# EAGLE design BitrisATMEGA (EAGLE 9.5.0)
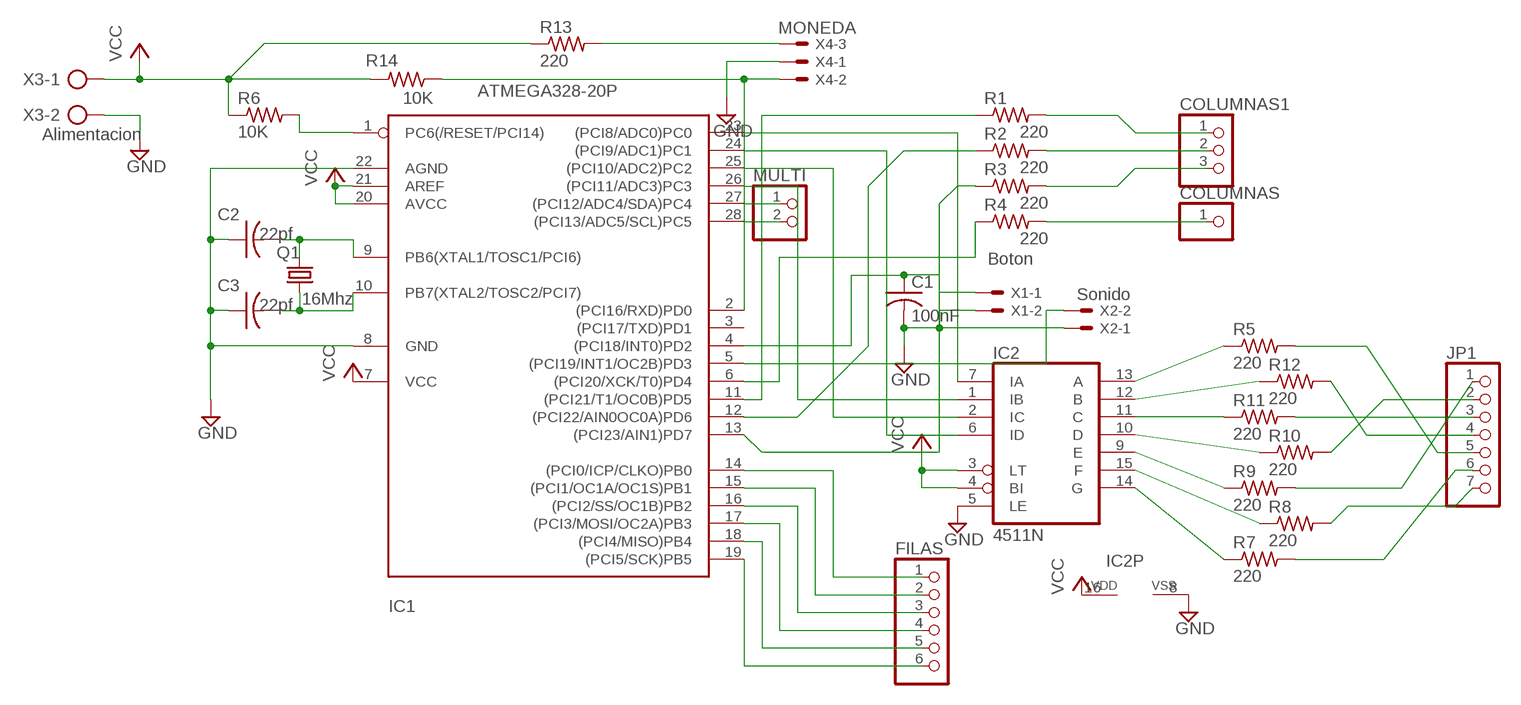
[diagram p0: schematic, sheet 1]

## Parts
C1  100nF  C-USC0805  [C0805]
C2  22pf  C-USC0805  [C0805]
C3  22pf  C-USC0805  [C0805]
COLUMNAS  PINHD-1X1  [1X01]
COLUMNAS1  PINHD-1X3  [1X03]
FILAS  PINHD-1X6  [1X06]
IC1  ATMEGA328-20P  [DIL28-3]
IC2  4511N  [DIL16]
JP1  PINHD-1X7  [1X07]
MULTI  PINHD-1X2  [1X02]
Q1  16Mhz  CRYSTALHC49S  [HC49/S]
R1  220  R-US_M0805  [M0805]
R2  220  R-US_M0805  [M0805]
R3  220  R-US_M0805  [M0805]
R4  220  R-US_0204/5  [0204/5]
R5  220  R-US_M0805  [M0805]
R6  10K  R-US_M0805  [M0805]
R7  220  R-US_M0805  [M0805]
R8  220  R-US_M0805  [M0805]
R9  220  R-US_M0805  [M0805]
R10  220  R-US_M0805  [M0805]
R11  220  R-US_M0805  [M0805]
R12  220  R-US_M0805  [M0805]
R13  220  R-US_M0805  [M0805]
R14  10K  R-US_M0805  [M0805]
X1  Boton  22-23-2021  [22-23-2021]
X2  Sonido  22-23-2021  [22-23-2021]
X3  Alimentacion  AK500/2  [AK500/2]
X4  MONEDA  22-23-2031  [22-23-2031]

## Nets
GND: C1.2 C2.1 C3.1 IC1.8(GND) IC1.22(AGND) IC2.5(LE) IC2.8(VSS) X1.2 X2.1 X3.2 X4.1
N$1: COLUMNAS1.1 R1.2
N$2: COLUMNAS1.2 R2.2
N$3: COLUMNAS1.3 R3.2
N$4: COLUMNAS.1 R4.2
N$5: IC1.23((PCI8/ADC0)PC0) IC2.7(IA)
N$6: IC1.24((PCI9/ADC1)PC1) IC2.6(ID)
N$7: IC1.25((PCI10/ADC2)PC2) IC2.2(IC)
N$8: IC1.26((PCI11/ADC3)PC3) IC2.1(IB)
N$9: FILAS.1 IC1.14((PCI0/ICP/CLKO)PB0)
N$10: FILAS.2 IC1.15((PCI1/OC1A/OC1S)PB1)
N$11: FILAS.3 IC1.16((PCI2/SS/OC1B)PB2)
N$12: FILAS.4 IC1.17((PCI3/MOSI/OC2A)PB3)
N$13: FILAS.5 IC1.18((PCI4/MISO)PB4)
N$14: FILAS.6 IC1.19((PCI5/SCK)PB5)
N$15: IC1.27((PCI12/ADC4/SDA)PC4) MULTI.1
N$16: IC1.28((PCI13/ADC5/SCL)PC5) MULTI.2
N$17: IC1.6((PCI20/XCK/T0)PD4) R4.1
N$18: IC1.11((PCI21/T1/OC0B)PD5) R1.1
N$19: C2.2 IC1.9(PB6(XTAL1/TOSC1/PCI6)) Q1.2
N$20: C3.2 IC1.10(PB7(XTAL2/TOSC2/PCI7)) Q1.1
N$21: IC1.13((PCI23/AIN1)PD7) R3.1
N$23: IC2.10(D) R10.1
N$24: IC2.11(C) R11.1
N$25: IC2.12(B) R12.1
N$26: IC2.13(A) R5.1
N$27: IC2.9(E) R9.1
N$28: IC2.15(F) R8.1
N$29: IC2.14(G) R7.1
N$30: IC1.2((PCI16/RXD)PD0) R14.1 X4.2
N$32: IC1.5((PCI19/INT1/OC2B)PD3) X2.2
N$33: C1.1 IC1.4((PCI18/INT0)PD2) X1.1
N$34: IC1.1(PC6(/RESET/PCI14)) R6.2
N$35: JP1.1 R9.2
N$36: JP1.2 R10.2
N$37: JP1.3 R11.2
N$38: JP1.4 R12.2
N$39: JP1.5 R5.2
N$40: JP1.6 R7.2
N$41: JP1.7 R8.2
N$44: R13.2 X4.3
N$45: IC1.12((PCI22/AIN0OC0A)PD6) R2.1
VCC: IC1.7(VCC) IC1.20(AVCC) IC1.21(AREF) IC2.3(LT) IC2.4(BI) IC2.16(VDD) R6.1 R13.1 R14.2 X3.1
Unconnected: IC1.3((PCI17/TXD)PD1)

## Library data of the parts
C1-C3 = rcl:C-US: CAPACITOR, American symbol
COLUMNAS = pinhead:PINHD-1X1: PIN HEADER
COLUMNAS1 = pinhead:PINHD-1X3: PIN HEADER
FILAS = pinhead:PINHD-1X6: PIN HEADER
IC1 = atmega328:ATMEGA328*P: MICROCONTROLLER 32 kBytes FLASH 2 kBytes SRAM 1 kBytes EEPROM USART 8-channel 10 bit ADC
IC2 = 45xx:4511: BCD to 7-segment LATCH/DECODER/DRIVER
JP1 = pinhead:PINHD-1X7: PIN HEADER
MULTI = pinhead:PINHD-1X2: PIN HEADER
Q1 = crystal:CRYSTAL: CRYSTAL; OC_FARNELL: 1667008; OC_NEWARK: unknown
R1-R14 = rcl:R-US_: RESISTOR, American symbol
X1 X2 = con-molex:22-23-2021: .100" (2.54mm) Center Header - 2 Pin; MF: MOLEX; MPN: 22-23-2021; OC_FARNELL: 1462926; OC_NEWARK: 25C3832
X3 = con-ptr500:AK500/2: CONNECTOR; OC_FARNELL: unknown; OC_NEWARK: unknown
X4 = con-molex:22-23-2031: .100" (2.54mm) Center Header - 3 Pin; MF: MOLEX; MPN: 22-23-2031; OC_FARNELL: 1462950; OC_NEWARK: 30C0862

## Board
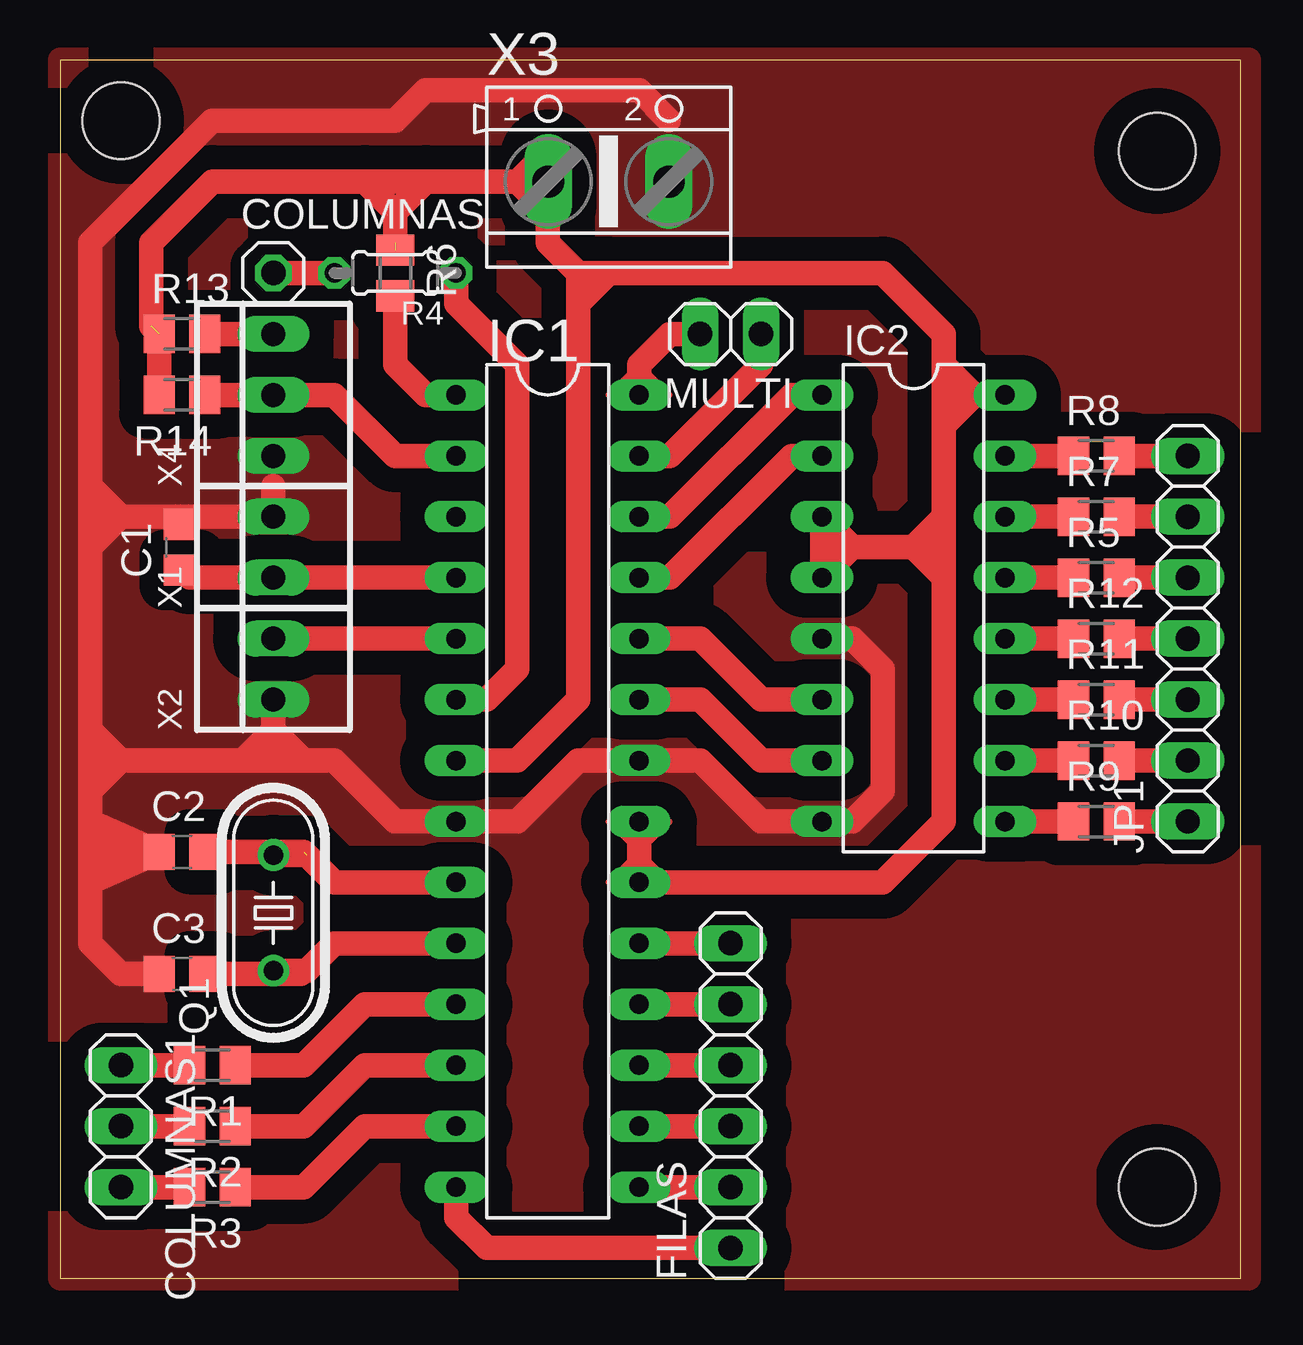
[diagram p1: board, top side]

Size 49.2 x 50.79 mm. Coordinates in mm from the lower left corner, seen from the top.
Outline: 0,0 49.2,0 49.2,50.79 0,50.79 0,0
Copper layers (1*16): Top 0.035mm / dielectric 1.5mm / Bottom 0.035mm
Design rules "default *": minimum track width 10mil, minimum drill 24mil, track to track 8mil, track to pad 8mil, pad to pad 8mil, via to via 8mil, smd to smd 8mil, copper to edge 0mil, drill to drill 8mil, minimum pad ring 10mil, minimum via ring 8mil, stop-mask expansion 4mil, vias tented up to drill 0mil, thermal gap 10mil
Holes 3.2 mm at 45.72,3.81 2.54,48.26 45.72,46.99

### Footprints (pad centres in the part's own frame; a part is rotated, then mirrored left to right if it is on the bottom)
C0805 = smd 1.3 x 1.5: 1 -0.95,0; 2 0.95,0
1X01 = drill 1.016 octagon: 1 0,0
1X03 = drill 1.016 long: 1 -2.54,0; 2 0,0; 3 2.54,0
1X06 = drill 1.016 long: 1 -6.35,0; 2 -3.81,0; 3 -1.27,0; 4 1.27,0; 5 3.81,0; 6 6.35,0
DIL28-3 = drill 0.813 long: 1 -16.51,-3.81; 2 -13.97,-3.81; 3 -11.43,-3.81; 4 -8.89,-3.81; 5 -6.35,-3.81; 6 -3.81,-3.81; 7 -1.27,-3.81; 8 1.27,-3.81; 9 3.81,-3.81; 10 6.35,-3.81; 11 8.89,-3.81; 12 11.43,-3.81; 13 13.97,-3.81; 14 16.51,-3.81; 15 16.51,3.81; 16 13.97,3.81; 17 11.43,3.81; 18 8.89,3.81; 19 6.35,3.81; 20 3.81,3.81; 21 1.27,3.81; 22 -1.27,3.81; 23 -3.81,3.81; 24 -6.35,3.81; 25 -8.89,3.81; 26 -11.43,3.81; 27 -13.97,3.81; 28 -16.51,3.81
DIL16 = drill 0.813 long: 1 -8.89,-3.81; 2 -6.35,-3.81; 3 -3.81,-3.81; 4 -1.27,-3.81; 5 1.27,-3.81; 6 3.81,-3.81; 7 6.35,-3.81; 8 8.89,-3.81; 9 8.89,3.81; 10 6.35,3.81; 11 3.81,3.81; 12 1.27,3.81; 13 -1.27,3.81; 14 -3.81,3.81; 15 -6.35,3.81; 16 -8.89,3.81
1X07 = drill 1.016 long: 1 -7.62,0; 2 -5.08,0; 3 -2.54,0; 4 0,0; 5 2.54,0; 6 5.08,0; 7 7.62,0
1X02 = drill 1.016 long: 1 -1.27,0; 2 1.27,0
HC49/S = drill 0.813: 1 -2.413,0; 2 2.413,0
M0805 = smd 1.3 x 1.6: 1 -0.95,0; 2 0.95,0
0204/5 = drill 0.813 octagon: 1 -2.54,0; 2 2.54,0
22-23-2021 = drill 1 long: 1 -1.27,0; 2 1.27,0
AK500/2 = drill 1.321 long: 1 -2.515,0; 2 2.515,0
22-23-2031 = drill 1 long: 1 -2.54,0; 2 0,0; 3 2.54,0

### Placement (x,y rotation side)
C1  5.08,30.48 90 top
C2  5.08,17.78 0 top
C3  5.08,12.7 0 top
COLUMNAS  8.89,41.91 0 top
COLUMNAS1  2.54,6.35 270 top
FILAS  27.94,7.62 90 top
IC1  20.32,20.32 270 top
IC2  35.56,27.94 270 top
JP1  46.99,26.67 90 top
MULTI  27.94,39.37 180 top
Q1  8.89,15.24 90 top
R1  6.35,8.89 180 top
R2  6.35,6.35 180 top
R3  6.35,3.81 180 top
R4  13.97,41.91 180 top
R5  43.18,29.21 0 top
R6  13.97,41.91 270 top
R7  43.18,31.75 0 top
R8  43.18,34.29 0 top
R9  43.18,19.05 0 top
R10  43.18,21.59 0 top
R11  43.18,24.13 0 top
R12  43.18,26.67 0 top
R13  5.08,39.37 0 top
R14  5.08,36.83 180 top
X1  8.89,30.48 90 top
X2  8.89,25.4 90 top
X3  22.86,45.72 0 top
X4  8.89,36.83 90 top

### Tracks (layer width: path | path; a pad name or v marks a point on that pad's centre or on a via)
GND
  Top 1.016: 7.62,21.59 8.89,21.59 | 8.89,21.59 10.16,21.59 | 10.16,21.59 11.43,21.59 13.97,19.05 IC1.8 19.05,19.05 21.59,21.59 IC1.22 | 8.89,22.86 8.89,21.59 | 10.16,21.59 8.89,22.86 | 8.89,22.86 7.62,21.59 | IC2.5 33.02,26.67 34.29,25.4 34.29,20.32 33.02,19.05 IC2.8 29.21,19.05 26.67,21.59 IC1.22 | IC1.22 25.4,21.59 | 2.54,31.75 1.27,31.75 | 1.27,21.59 1.27,20.32 | 1.27,20.32 1.27,19.05 | 1.27,19.05 1.27,17.78 | 1.27,17.78 1.27,16.51 | 1.27,16.51 1.27,13.97 2.54,12.7 C3.1 | C2.1 1.27,17.78 | 7.62,21.59 2.54,21.59 | 2.54,21.59 1.27,21.59 | 1.27,33.02 1.27,31.75 | 1.27,31.75 1.27,30.48 | 1.27,30.48 1.27,22.86 | 1.27,22.86 1.27,21.59 | 1.27,22.86 2.54,21.59 | 2.54,21.59 1.27,20.32 | 1.27,16.51 C2.1 | C2.1 1.27,19.05 | 1.27,30.48 2.54,31.75 | 2.54,31.75 1.27,33.02 | 25.38,48.28 24.13,49.53 15.24,49.53 13.97,48.26 6.35,48.26 1.27,43.18 1.27,33.02 | X2.1 8.89,22.86 | 8.89,33.02 X1.2 5.4,31.75 C1.2 | C1.2 5.08,31.75 | 2.54,31.75 4.76,31.75 C1.2
  pour Top (isolate 1.016, no thermals): 0,50.8 49.53,50.8 49.53,0 0,0
N$1
  Top 1.016: R1.2 COLUMNAS1.1
N$2
  Top 1.016: R2.2 COLUMNAS1.2
N$3
  Top 1.016: R3.2 COLUMNAS1.3
N$4
  Top 1.016: COLUMNAS.1 R4.2
N$5
  Top 1.016: IC1.23 26.67,24.13 29.21,21.59 IC2.7
N$6
  Top 1.016: IC1.24 26.67,26.67 29.21,24.13 IC2.6
N$7
  Top 1.016: IC2.2 30.48,34.29 25.4,29.21 IC1.25
N$8
  Top 1.016: IC1.26 25.4,31.75 30.48,36.83 IC2.1
N$9
  Top 1.016: IC1.14 16.51,2.54 17.78,1.27 FILAS.1
N$10
  Top 1.016: IC1.15 FILAS.2
N$11
  Top 1.016: FILAS.3 IC1.16
N$12
  Top 1.016: IC1.17 FILAS.4
N$13
  Top 1.016: FILAS.5 IC1.18
N$14
  Top 1.016: IC1.19 FILAS.6
N$15
  Top 1.016: IC1.27 25.4,34.29 29.21,38.1 MULTI.1
N$16
  Top 0.254: 25.4,36.83 24.13,38.1 22.86,36.83 25.4,36.83
  Top 1.016: IC1.28 24.13,38.1 25.4,39.37 MULTI.2
N$17
  Top 1.016: IC1.6 17.78,24.13 19.05,25.4 19.05,38.1 16.51,40.64 R4.1
N$18
  Top 1.016: R1.1 10.16,8.89 12.7,11.43 IC1.11
N$19  (1 unrouted)
  Top 1.016: Q1.2 10.29,17.65 11.43,16.51 IC1.9 | C2.2 10.16,17.78
N$20
  Top 1.016: IC1.10 11.43,13.97 10.29,12.83 Q1.1 10.03,12.7 C3.2
N$21
  Top 1.016: R3.1 10.16,3.81 12.7,6.35 IC1.13
N$23
  Top 1.016: R10.1 IC2.10
N$24
  Top 1.016: R11.1 IC2.11
N$25
  Top 1.016: R12.1 IC2.12
N$26
  Top 1.016: R5.1 IC2.13
N$27
  Top 1.016: R9.1 IC2.9
N$28
  Top 1.016: R8.1 IC2.15
N$29
  Top 1.016: R7.1 IC2.14
N$30
  Top 1.016: IC1.2 13.97,34.29 11.43,36.83 X4.2 R14.1
N$32
  Top 1.016: IC1.5 X2.2
N$33
  Top 1.016: IC1.4 X1.1 5.4,29.21 C1.1
N$34
  Top 1.016: IC1.1 15.24,36.83 13.97,38.1 R6.2
N$35
  Top 1.016: R9.2 JP1.1
N$36
  Top 1.016: R10.2 JP1.2
N$37
  Top 1.016: R11.2 JP1.3
N$38
  Top 1.016: R12.2 JP1.4
N$39
  Top 1.016: R5.2 JP1.5
N$40
  Top 1.016: R7.2 JP1.6
N$41
  Top 1.016: R8.2 JP1.7
N$42
  pour Top: 30.48,1.27 30.48,13.97 43.18,13.97 43.18,1.27
N$44
  Top 1.016: R13.2 X4.3
N$45
  Top 1.016: R2.1 10.16,6.35 12.7,8.89 IC1.12
VCC  (2 unrouted)
  Top 0.254: 25.4,19.05 24.13,17.78 | 24.13,17.78 22.86,19.05 | 25.4,16.51 24.13,17.78 | 24.13,17.78 22.86,16.51
  Top 1.016: 31.75,30.48 IC2.4 33.02,30.48 | IC1.7 19.05,21.59 21.59,24.13 21.59,40.64 | 21.59,40.64 21.59,41.91 | IC1.21 24.13,17.78 IC1.20 25.4,16.51 34.29,16.51 36.83,19.05 36.83,29.21 | 21.59,41.91 22.86,41.91 | 22.86,41.91 34.29,41.91 36.83,39.37 36.83,38.1 | 36.83,38.1 36.83,36.83 | 36.83,36.83 36.83,35.56 | 36.83,35.56 36.83,31.75 | 36.83,31.75 36.83,30.48 | 36.83,30.48 36.83,29.21 | 31.75,30.48 IC2.3 33.02,30.48 | 31.75,30.48 33.02,30.48 | 33.02,30.48 35.56,30.48 | 35.56,30.48 36.83,30.48 | IC2.16 38.1,36.83 | 38.1,36.83 36.83,36.83 | 36.83,35.56 38.1,36.83 | 38.1,36.83 36.83,38.1 | 36.83,31.75 35.56,30.48 | 35.56,30.48 36.83,29.21 | 13.97,43.18 13.97,44.45 | 13.97,44.45 15.24,45.72 | 15.24,45.72 19.05,45.72 | 20.32,45.72 X3.1 20.32,45.7 20.32,44.45 | 20.32,45.72 19.05,45.72 | 12.7,45.72 6.35,45.72 3.81,43.18 3.81,39.69 | 12.7,45.72 15.24,45.72 | 20.32,44.45 20.32,43.18 21.59,41.91 | 21.59,40.64 22.86,41.91 | 13.97,44.45 12.7,45.72 | 19.05,45.72 20.32,46.99 20.32,45.72 | 19.05,45.72 20.32,44.45 | R13.1 R14.2

### Text on the board
tRestrict: 7°1° | Campos | Obregón | Perez